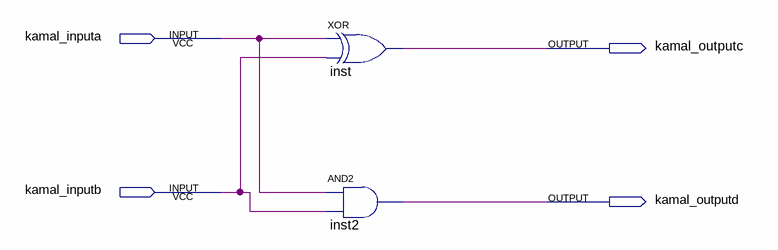
[diagram p0: schematic sheet]
// Quartus schematic kamal_lab1halfadder.bdf as structural Verilog: 2 symbols, 4 pins
module kamal_lab1halfadder (
  input  kamal_inputa,
  input  kamal_inputb,
  output kamal_outputc,
  output kamal_outputd
);

  xor inst (kamal_outputc, kamal_inputa, kamal_inputb);
  and inst2 (kamal_outputd, kamal_inputa, kamal_inputb);
endmodule
